# EAGLE design Callisto_LSPX_v1p0 (EAGLE 9.6.2)
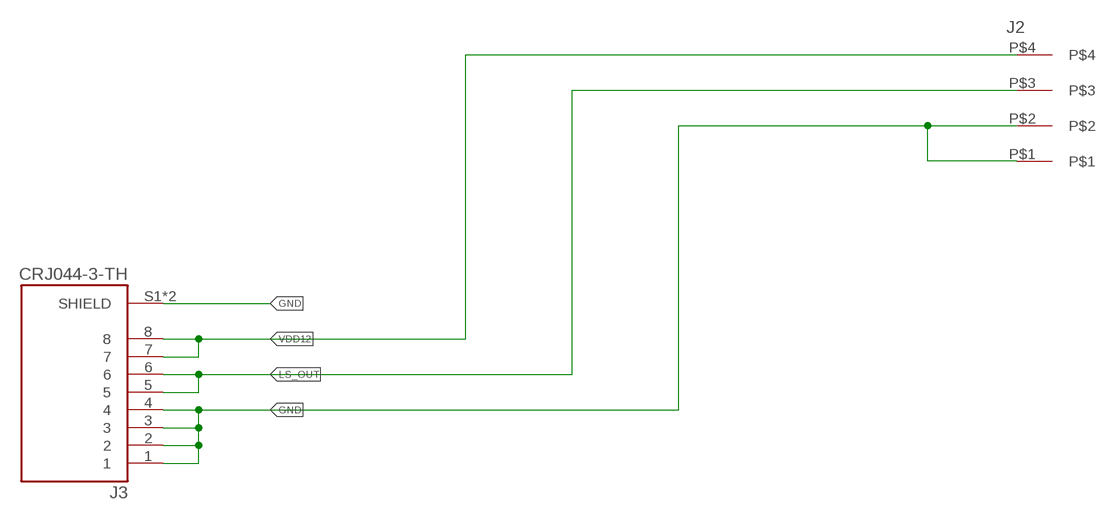
[diagram p0: schematic, sheet 1]

## Parts
J2  4-pos  3.81MM_1_X_4_RT_ANGLE_PLUG_HEADER  [1X4_3.81MM_PITCH]
J3  CRJ044-3-TH  [CUI_CRJ044-3-TH]

## Nets
GND: J2.P$1 J2.P$2 J3.1 J3.2 J3.3 J3.4 J3.S1(SHIELD) J3.S2(SHIELD)
LS_OUT: J2.P$3 J3.5 J3.6
VDD12: J2.P$4 J3.7 J3.8

## Library data of the parts
J2 = 3D_MIG_Controller:3.81MM_1_X_4_RT_ANGLE_PLUG_HEADER: 4 Position Terminal Block Header, Male Pins, Shrouded (4 Side) 0.150" (3.81mm) 90°, Right Angle - Through Hole; PARTNO: 691322310004
J3 = 3D_MIG_Controller:CRJ044-3-TH: Modular Jack; MAXIMUM_PACKAGE_HEIGHT: 13.46 mm; PARTREV: 1.0; STANDARD: Manufacturer Recommendations

## Board
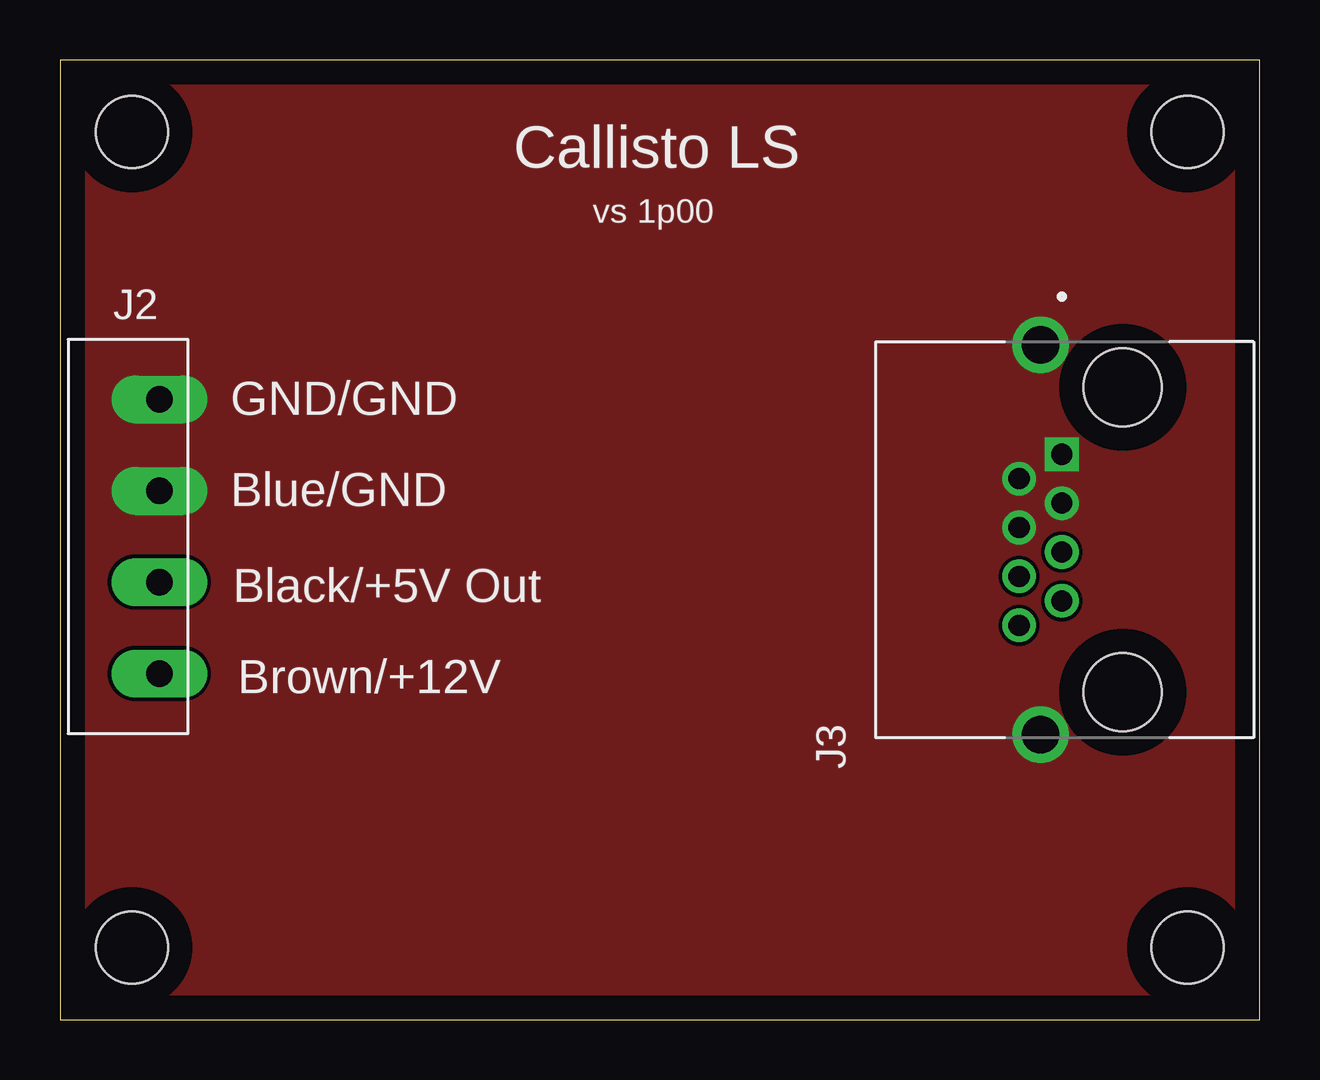
[diagram p1: board, top side]
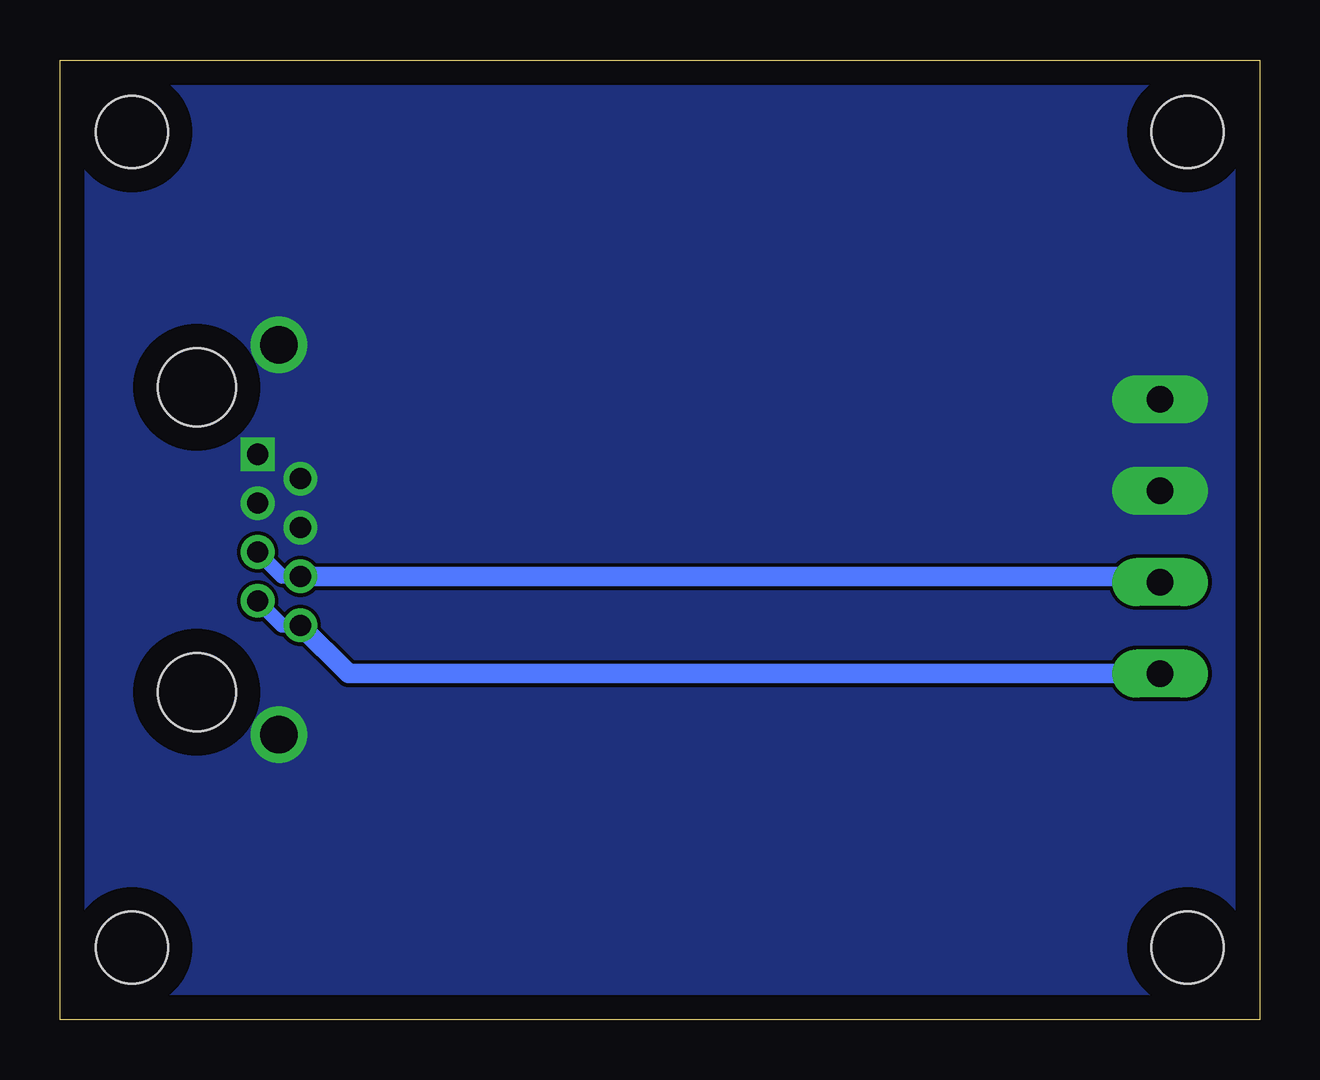
[diagram p2: board, bottom side, seen from below]

Size 50 x 40 mm. Coordinates in mm from the lower left corner, seen from the top.
Outline: 0,0 50,0 50,40 0,40 0,0
Copper layers (1*16): Top 0.035mm / dielectric 1.5mm / Bottom 0.035mm
Design rules "default": minimum track width 6mil, minimum drill 0.35mm, track to track 6mil, track to pad 6mil, pad to pad 6mil, via to via 6mil, smd to smd 6mil, copper to edge 40mil, drill to drill 6mil, minimum pad ring 10mil, minimum via ring 8mil, stop-mask expansion 4mil, vias tented up to drill 0mil, thermal gap 10mil
Holes 3 mm at 3,3 47,3 3,37 47,37

### Footprints (pad centres in the part's own frame; a part is rotated, then mirrored left to right if it is on the bottom)
1X4_3.81MM_PITCH = drill 1.1 pad 2 long: P$1 0,0; P$2 3.81,0; P$3 7.62,0; P$4 11.43,0
CUI_CRJ044-3-TH = drill 0.89 square: 1 3.57,2.54 | drill 0.89: 2 2.55,4.32; 3 1.53,2.54; 4 0.51,4.32; 5 -0.51,2.54; 6 -1.53,4.32; 7 -2.55,2.54; 8 -3.57,4.32 | drill 1.57: S1 8.13,3.43; S2 -8.13,3.43 | hole 3.25: -6.35,0; 6.35,0

### Placement (x,y rotation side)
J2  4.14,25.85 270 top
J3  44.3,20 90 top

### Tracks (layer width: path | path; a pad name or v marks a point on that pad's centre or on a via)
GND
  pour Bottom (no thermals): 0,40 50,40 50,0 0,0
  pour Top (no thermals): 0,40 50,40 50,0 0,0
LS_OUT
  Bottom 0.61: J3.5 40.74,18.47 J3.6
  Bottom 0.813: J3.6 4.38,18.47 J2.P$3
VDD12
  Bottom 0.61: J3.7 40.74,16.43 J3.8
  Bottom 0.813: J3.8 37.97,14.42 J2.P$4

### Text on the board
tPlace: Callisto LS | vs 1p00 | GND/GND | Blue/GND | Black/+5V Out | Brown/+12V